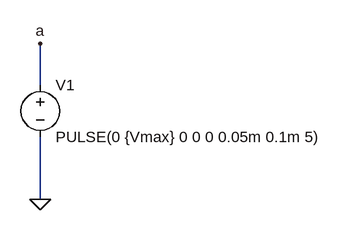
[diagram p0: schematic motor.asc]
motor.asc, the LTspice schematic file:
Version 4
SHEET 1 1172 692
WIRE 160 128 160 64
WIRE 160 304 160 208
FLAG 160 64 a
FLAG 160 304 0
SYMBOL voltage 160 112 R0
SYMATTR InstName V1
SYMATTR Value PULSE(0 {Vmax} 0 0 0 0.05m 0.1m 5)

The netlist it stands for:
* motor.asc
V1 a 0 PULSE(0 {Vmax} 0 0 0 0.05m 0.1m 5)
.backanno
.end